# Altium schematic sheet Open_door_sensor_scheme.SchDoc
size A4
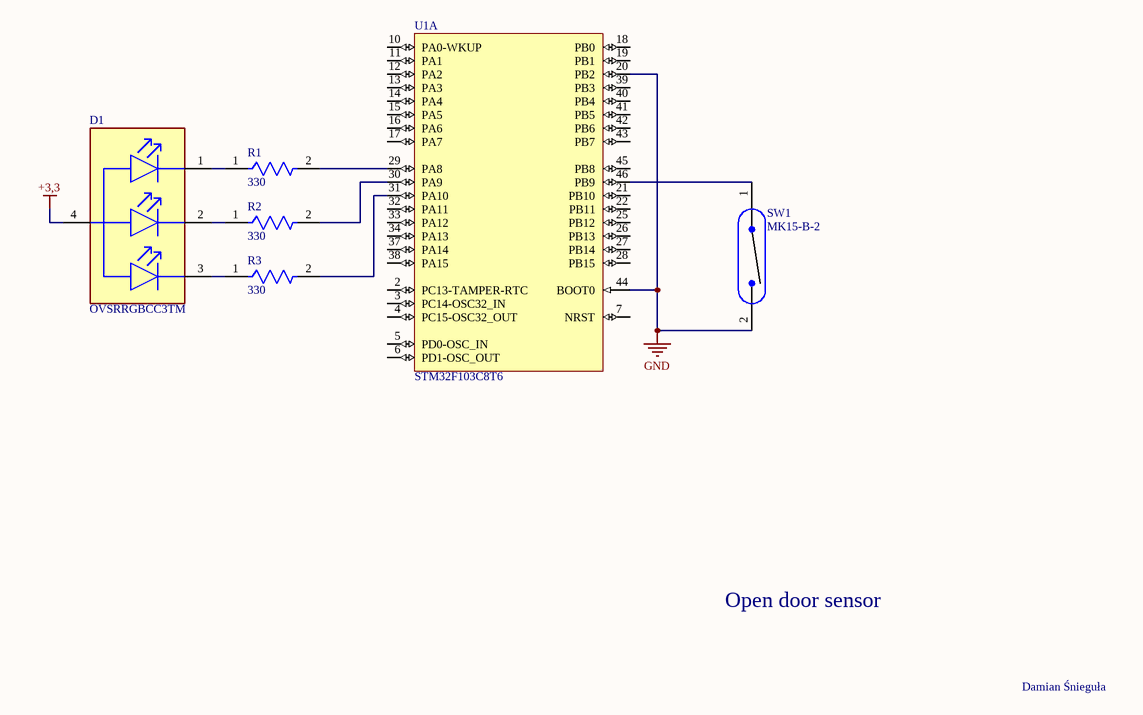
[diagram p0: Open_door_sensor_scheme.SchDoc]

## Parts
D1  OVSRRGBCC3TM  [FP-OVSRRGBCC3TM-MFG]
R1  330  [FP-CRCW0603-e3-MFG]
R2  330  [FP-CRCW0603-e3-MFG]
R3  330  [FP-CRCW0603-e3-MFG]
SW1  MK15-B-2  [STAN-MK15-B-2_V]
U1  STM32F103C8T6  [STM-LQFP48_L]  (part A of 2)

## Nets
+3,3: D1.4(COMMON_ANODE)
GND: SW1.2 U1.20(PB2) U1.44(BOOT0)
NetD1_1: D1.1(RED_C) R1.1
NetD1_2: D1.2(GREEN_C) R2.1
NetD1_3: D1.3(BLUE_C) R3.1
NetR1_2: R1.2 U1.29(PA8)
NetR2_2: R2.2 U1.30(PA9)
NetR3_2: R3.2 U1.31(PA10)
NetSW1_1: SW1.1 U1.46(PB9)

Not connected (* = marked no-connect by the designer): U1 2(PC13-TAMPER-RTC) 3(PC14-OSC32_IN) 4(PC15-OSC32_OUT) 5(PD0-OSC_IN) 6(PD1-OSC_OUT) 7(NRST) 10(PA0-WKUP) 11(PA1) 12(PA2) 13(PA3) 14(PA4) 15(PA5) 16(PA6) 17(PA7) 18(PB0) 19(PB1) 21(PB10) 22(PB11) 25(PB12) 26(PB13) 27(PB14) 28(PB15) 32(PA11) 33(PA12) 34(PA13) 37(PA14) 38(PA15) 39(PB3) 40(PB4) 41(PB5) 42(PB6) 43(PB7) 45(PB8)

## Notes on the sheet
- Open door sensor
- Damian Śnieguła

## Library data of the parts
D1 = CMP-70659-000001-1: LED RGB DIFFUSED 1204 SMD; Color: Blue; Dominant Wavelength: 475nm; Lens Style: Dome; Luminous Intensity: 200mcd; Forward Voltage: 3.3V; Viewing Angle: 150°; Test Current: 20mA; Lens Color: White; Width: 1mm; Series: -; Case/Package: SMD/SMT; Packaging: Cut Tape; RoHS Compliant: Yes; Lens Transparency: Diffused; REACH SVHC: No SVHC; Lead Free: Lead Free; Length: 3.2mm; Height: 1.5mm; Mount: Surface Mount
R1-R3 = CMP-1012-00454-3: RES Thick Film, 330Ω, 1%, 0.1W, 100ppm/°C, 0603; Voltage Rating: 75V; Max Power Dissipation: 100mW; Resistance: 330R; Depth: 0.85mm; Contact Plating: Tin; Package Quantity: 10; Termination: SMD/SMT; Tolerance: 1%; Height: 0.45mm; Number of Terminations: 2; Radiation Hardening: No; Features: Automotive AEC-Q200; Case/Package: 0603; Mount: Surface Mount; Case Code (Metric): 1608; Lead Free: Lead Free; Temperature Coefficient: 100ppm/°C; Weight: 7.1E-05oz; Military Standard: Not; Packaging: Tape and Reel; Max Operating Temperature: 155°C; Voltage Rating (DC): 75V; Length: 1.55mm; Min Operating Temperature: -55°C; Composition: Thick Film; Case Code (Imperial): 0603; Width: 0.033inch; Power Rating: 100mW
SW1 = CMP-2000-06712-1: Reed Sensor, SPST-NO, 10 W, 180 V, -40 to 130 degC, 2-Pin SMD, RoHS, Tape and Reel; Manufacturer: Standex Meder; Datasheet URL: https://standexelectronics.com/wp-content/uploads/datasheet_reed_sensor_MK15.pdf; Datasheet Version: Rev. 01, 01/2015; Package Description: 2-Pin Surface Mount Device, Body 16 x 2.5 mm; Mounting Technology: SurfaceMount; Manufacturer URL: https://standexelectronics.com; Package URL: http://www.farnell.com/datasheets/34737.pdf; Package Reference: MK15-B-2
U1 = CMP-0237-00215-3: ARM Cortex-M3 32-bit MCU, 64 KB Flash, 20 KB Internal RAM, 37 I/Os, 48-pin LQFP, -40 to 85 degC, Tray; Supply Voltage(Vcc) min (V): 2; Internal RAM Size (kB): 20; FLASH Size (Prog) (kB): 64; A/D Converter: 2x12-bit (10 Channel); I/Os (High Current): 37; Operating Frequency(F) (Processor speed) (MHz): 72; Core: ARM Cortex-M3; ComponentLink3Description: Package Specification; Mounting Technology: Surface Mount; PartNumber: STM32F103C8T6; PackageReference: LQFP48; Packing: Tray; ComponentLink3URL: http://www.st.com/st-web-ui/static/active/en/resource/technical/document/datasheet/DM00058181.pdf; DatasheetVersion: Rev. 16; ComponentLink1URL: http://www.st.com/web/en/home.html; PackageVersion: Rev. 6, 06/2013; ComponentLink2URL: http://www.st.com/st-web-ui/static/active/en/resource/technical/document/datasheet/CD00161566.pdf; ComponentLink1Description: Manufacturer URL; ComponentLink2Description: Datasheet; PackageDescription: 48-Pin Low Profile Quad Flat Package, 7 x 7 mm Body, 0.5 mm Pitch